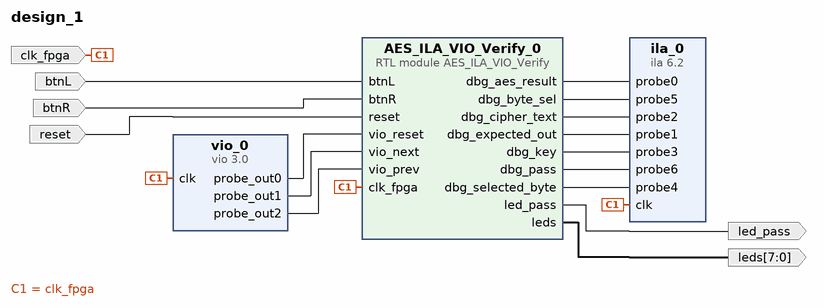
[diagram p0: block diagram of the top level]
# Vivado block design design_1, xc7a35tcpg236-1, Vivado 2025.1
create_bd_design design_1

create_bd_port -dir I btnL
create_bd_port -dir I btnR
create_bd_port -dir O led_pass
create_bd_port -dir O -from 7 -to 0 leds
create_bd_port -dir I -type rst reset
create_bd_port -dir I clk_fpga

create_bd_cell -type module -reference AES_ILA_VIO_Verify AES_ILA_VIO_Verify_0
create_bd_cell -type ip -vlnv xilinx.com:ip:ila:6.2 ila_0
set_property -dict [list \
  CONFIG.C_MONITOR_TYPE Native \
  CONFIG.C_NUM_OF_PROBES 7 \
  CONFIG.C_PROBE0_WIDTH 128 \
  CONFIG.C_PROBE1_WIDTH 128 \
  CONFIG.C_PROBE2_WIDTH 128 \
  CONFIG.C_PROBE3_WIDTH 128 \
  CONFIG.C_PROBE4_WIDTH 8 \
  CONFIG.C_PROBE5_WIDTH 4 \
] [get_bd_cells ila_0]
create_bd_cell -type ip -vlnv xilinx.com:ip:vio:3.0 vio_0
set_property -dict {CONFIG.C_NUM_PROBE_IN 0 CONFIG.C_NUM_PROBE_OUT 3} [get_bd_cells vio_0]

# ---- connections ----

connect_bd_net [get_bd_pins AES_ILA_VIO_Verify_0/dbg_aes_result] [get_bd_pins ila_0/probe0]
connect_bd_net [get_bd_pins AES_ILA_VIO_Verify_0/dbg_byte_sel] [get_bd_pins ila_0/probe5]
connect_bd_net [get_bd_pins AES_ILA_VIO_Verify_0/dbg_cipher_text] [get_bd_pins ila_0/probe2]
connect_bd_net [get_bd_pins AES_ILA_VIO_Verify_0/dbg_expected_out] [get_bd_pins ila_0/probe1]
connect_bd_net [get_bd_pins AES_ILA_VIO_Verify_0/dbg_key] [get_bd_pins ila_0/probe3]
connect_bd_net [get_bd_pins AES_ILA_VIO_Verify_0/dbg_pass] [get_bd_pins ila_0/probe6]
connect_bd_net [get_bd_pins AES_ILA_VIO_Verify_0/dbg_selected_byte] [get_bd_pins ila_0/probe4]
connect_bd_net [get_bd_pins AES_ILA_VIO_Verify_0/led_pass] [get_bd_ports led_pass]
connect_bd_net [get_bd_pins AES_ILA_VIO_Verify_0/leds] [get_bd_ports leds]
connect_bd_net -net btnL_0_1 [get_bd_ports btnL] [get_bd_pins AES_ILA_VIO_Verify_0/btnL]
connect_bd_net -net btnR_0_1 [get_bd_ports btnR] [get_bd_pins AES_ILA_VIO_Verify_0/btnR]
connect_bd_net -net clk_fpga_0_1 [get_bd_ports clk_fpga] [get_bd_pins vio_0/clk] [get_bd_pins ila_0/clk] [get_bd_pins AES_ILA_VIO_Verify_0/clk_fpga]
connect_bd_net -net reset_0_1 [get_bd_ports reset] [get_bd_pins AES_ILA_VIO_Verify_0/reset]
connect_bd_net [get_bd_pins vio_0/probe_out0] [get_bd_pins AES_ILA_VIO_Verify_0/vio_reset]
connect_bd_net [get_bd_pins vio_0/probe_out1] [get_bd_pins AES_ILA_VIO_Verify_0/vio_next]
connect_bd_net [get_bd_pins vio_0/probe_out2] [get_bd_pins AES_ILA_VIO_Verify_0/vio_prev]

validate_bd_design
save_bd_design
